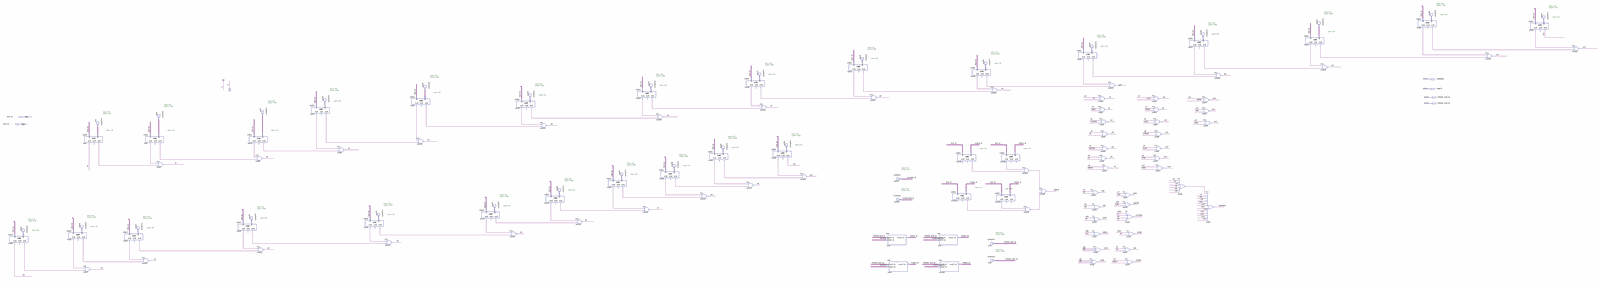
[diagram p0: schematic sheet, whole]
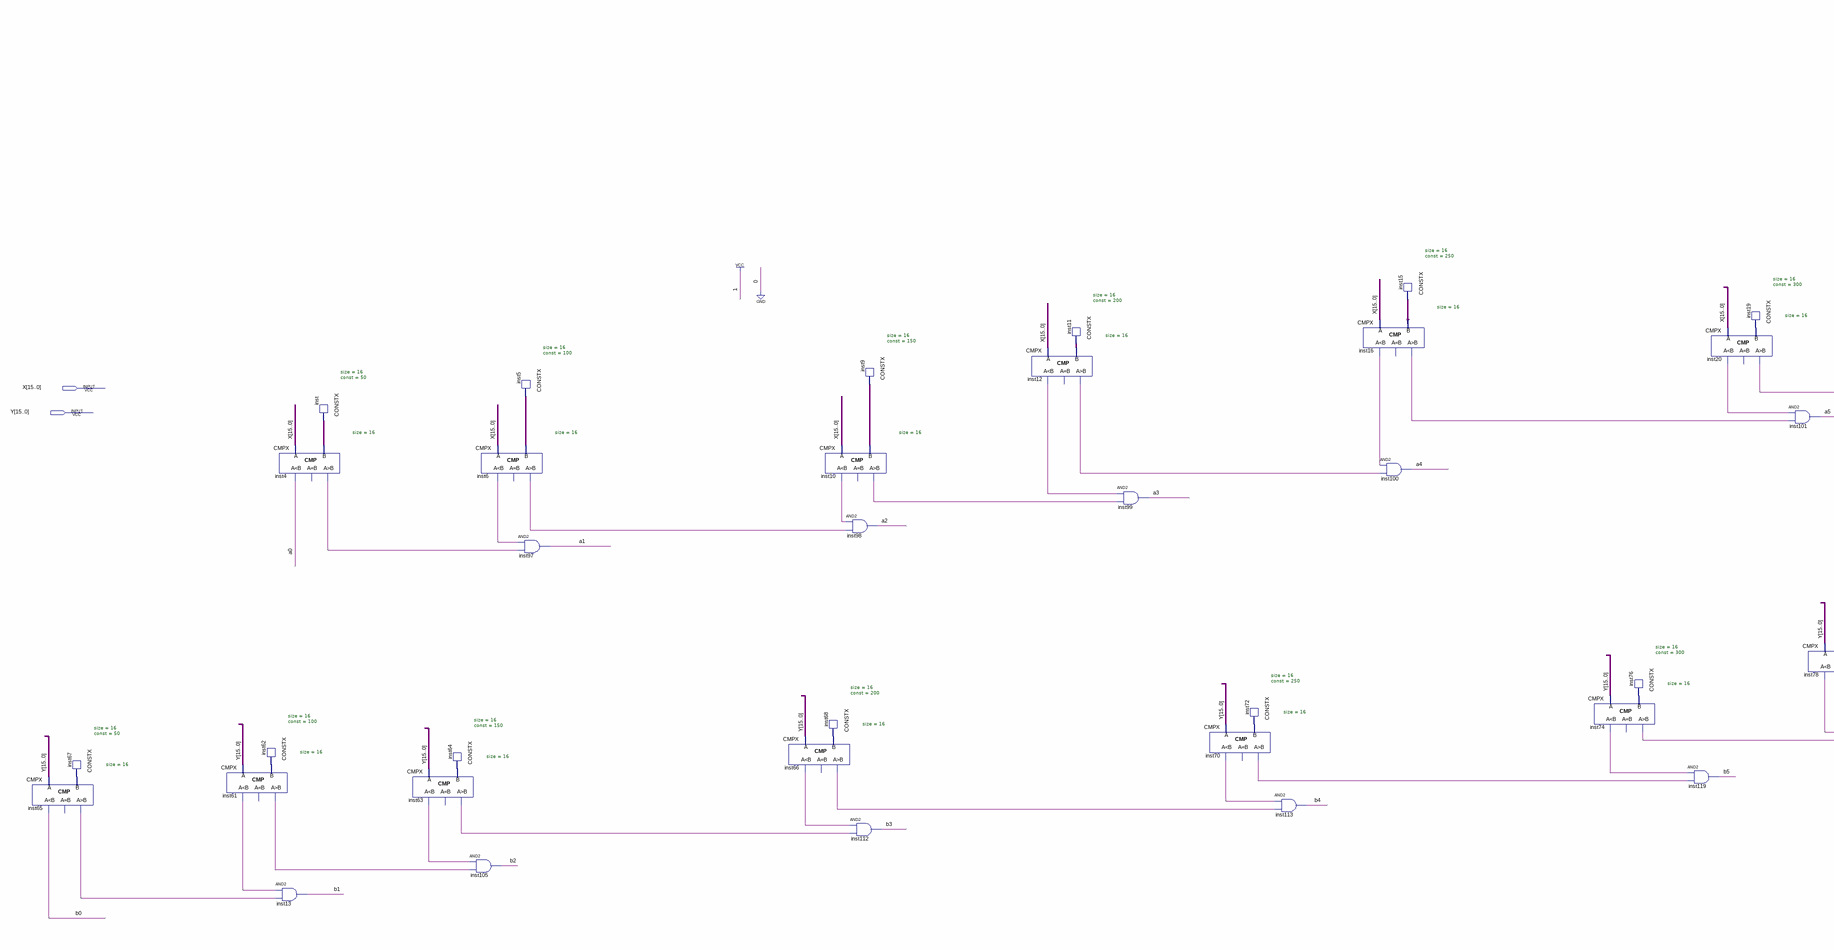
[diagram p1: schematic sheet, left part]
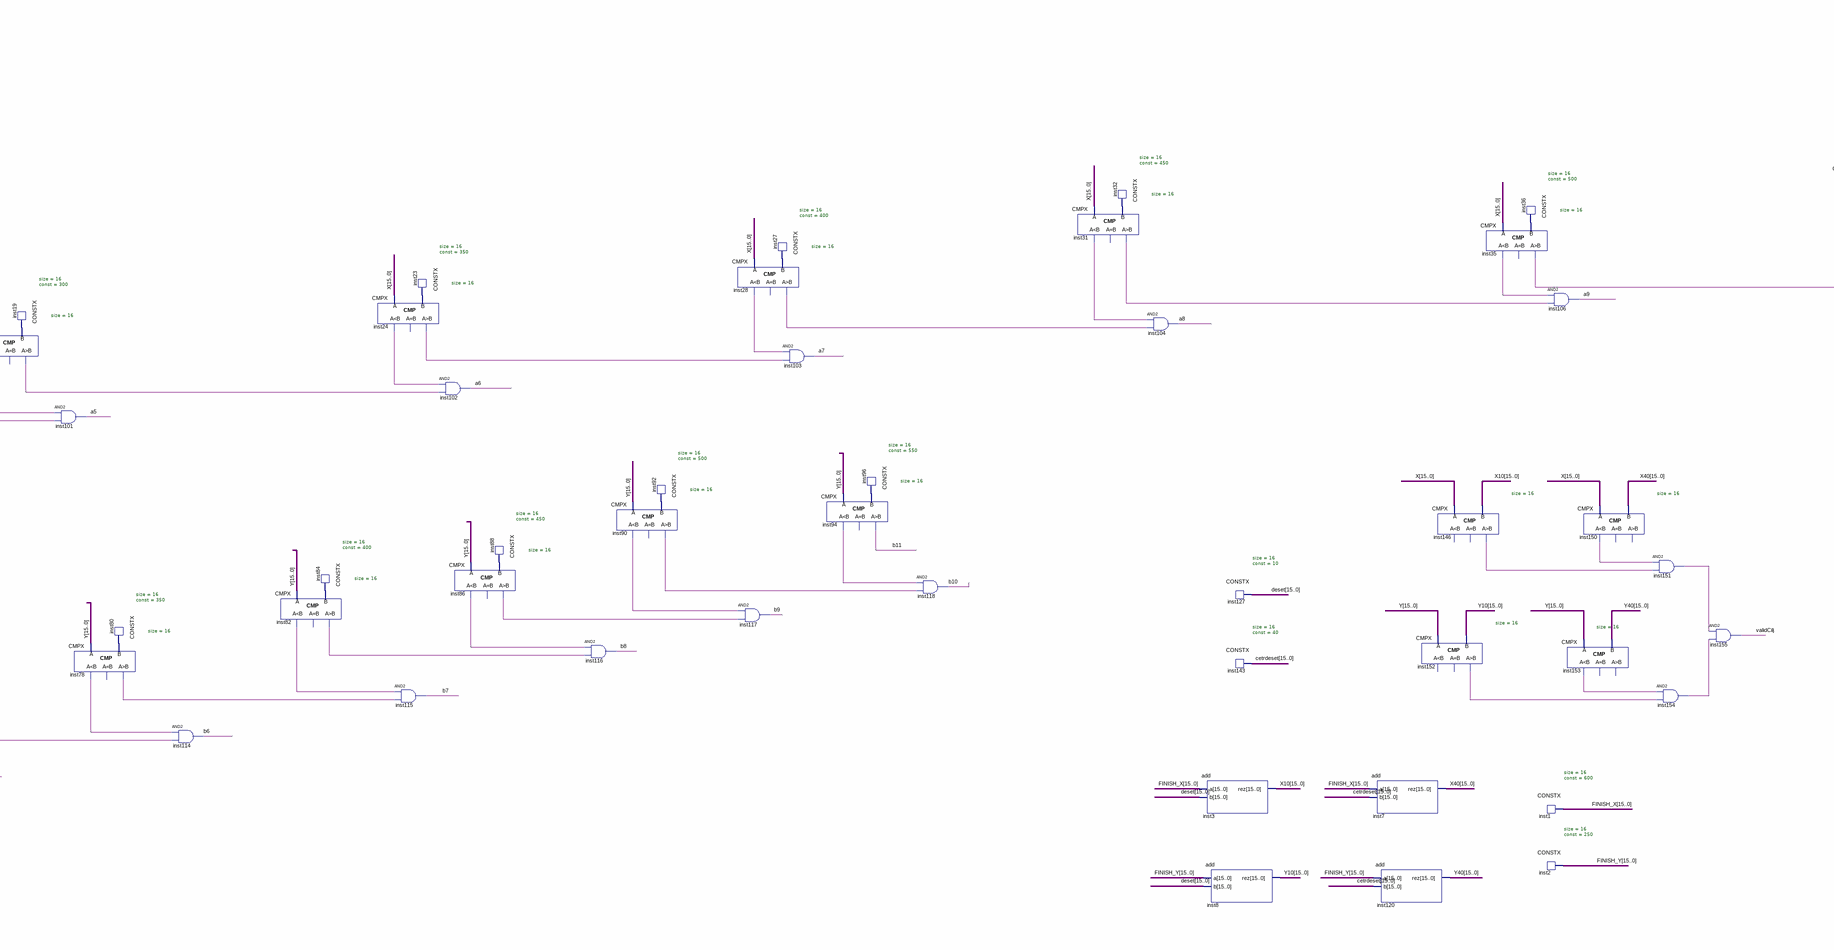
[diagram p2: schematic sheet, centre part]
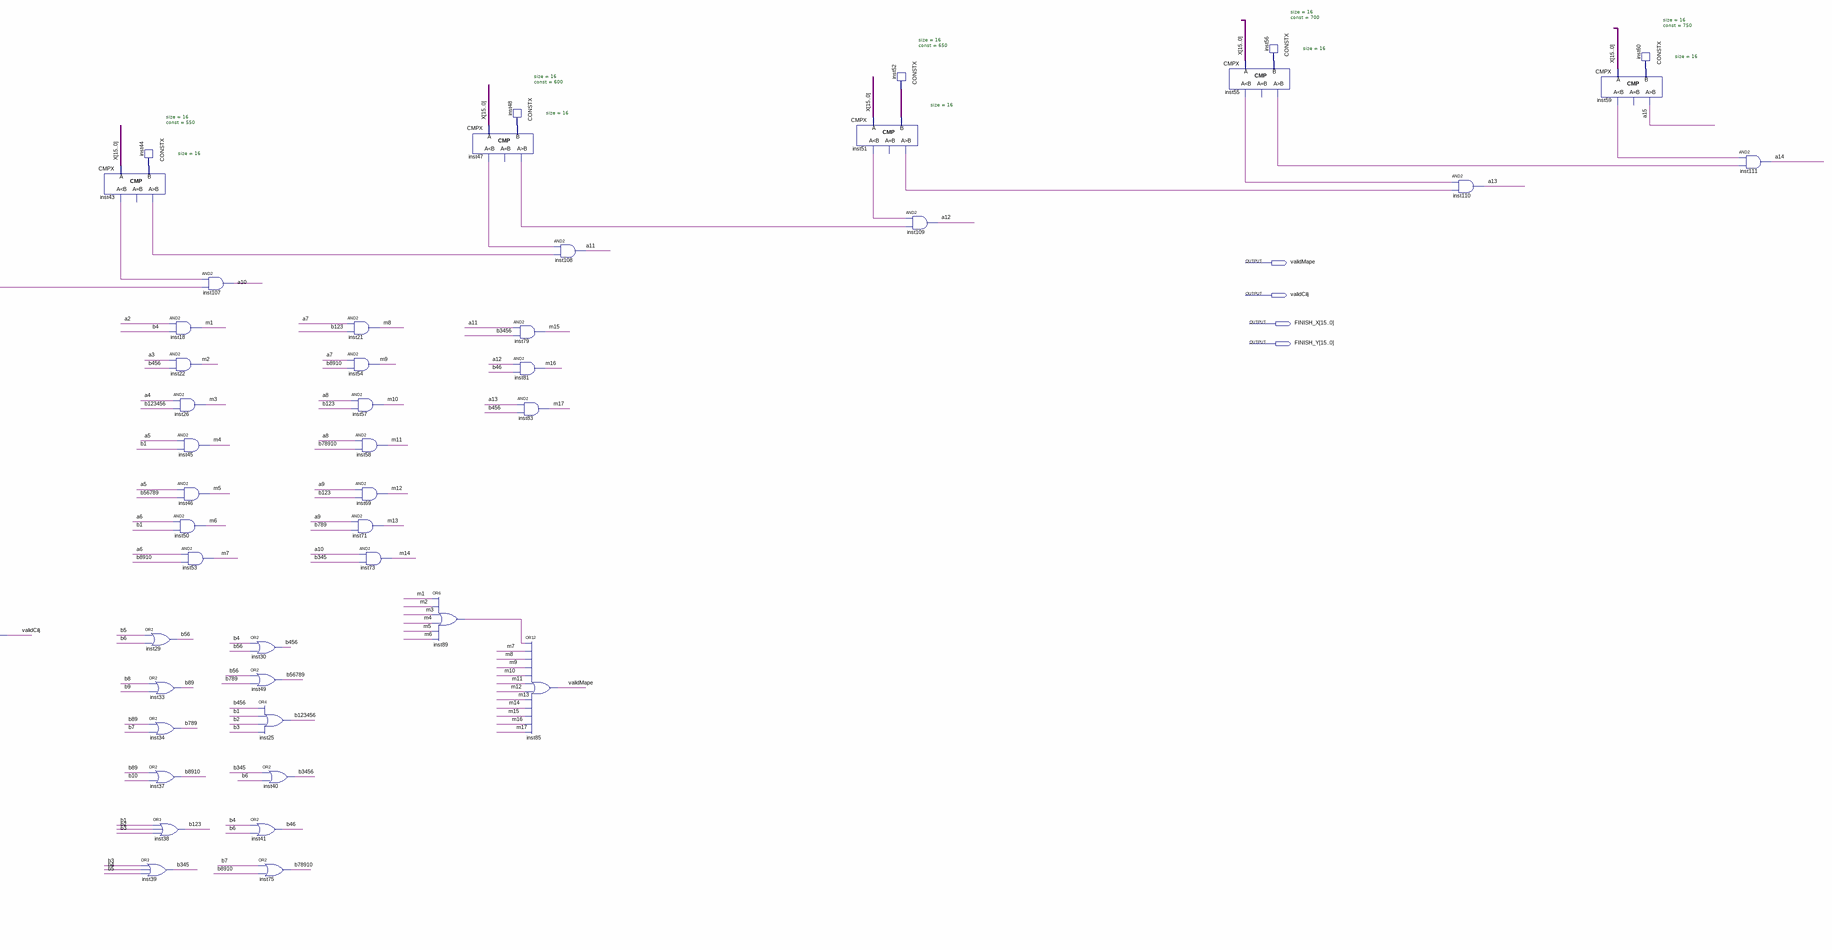
[diagram p3: schematic sheet, right part]
// Quartus schematic mapa2.bdf as structural Verilog: 122 symbols, 6 pins
module mapa2 (
  input  [15:0] X,
  input  [15:0] Y,
  output validMape,
  output validCilj,
  output [15:0] FINISH_X,
  output [15:0] FINISH_Y
);

  wire a0, a1, a2, a3, a4, a5, a6, a7, a8, a9, a10, a11, a12, a13, a14, a15, b0, b1, b2, b3, b4, b5, b6, b7,
       b8, b9, b10, b11, b46, b56, b89, b123, b345, b456, b789, b3456, b8910, b56789, b78910, b123456,
       inst4_gr, inst6_gr, inst6_ls, inst10_gr, inst10_ls, inst12_gr, inst12_ls, inst16_gr, inst16_ls,
       inst20_gr, inst20_ls, inst24_gr, inst24_ls, inst28_gr, inst28_ls, inst31_gr, inst31_ls, inst35_gr,
       inst35_ls, inst43_gr, inst43_ls, inst47_gr, inst47_ls, inst51_gr, inst51_ls, inst55_gr, inst55_ls,
       inst59_ls, inst61_gr, inst61_ls, inst63_gr, inst63_ls, inst65_gr, inst66_gr, inst66_ls, inst70_gr,
       inst70_ls, inst74_gr, inst74_ls, inst78_gr, inst78_ls, inst82_gr, inst82_ls, inst86_gr, inst86_ls,
       inst89_out, inst90_gr, inst90_ls, inst94_ls, inst146_gr, inst150_ls, inst151_out, inst152_gr,
       inst153_ls, inst154_out, m1, m2, m3, m4, m5, m6, m7, m8, m9, m10, m11, m12, m13, m14, m15, m16, m17;
  wire [15:0] cetrdeset, deset, inst5_data, inst9_data, inst11_data, inst15_data, inst19_data, inst23_data,
       inst27_data, inst32_data, inst36_data, inst44_data, inst48_data, inst52_data, inst56_data,
       inst60_data, inst62_data, inst64_data, inst67_data, inst68_data, inst72_data, inst76_data,
       inst80_data, inst84_data, inst88_data, inst92_data, inst96_data, inst_data, X10, X40, Y10, Y40;

  CMPX #(.size(16)) inst65 (.A(Y), .B(inst67_data), .ls(b0), .gr(inst65_gr));  // open: eq
  CONSTX #(.size(16), .\const (50)) inst67 (.data(inst67_data));
  CMPX #(.size(16)) inst61 (.A(Y), .B(inst62_data), .ls(inst61_ls), .gr(inst61_gr));  // open: eq
  CONSTX #(.size(16), .\const (100)) inst62 (.data(inst62_data));
  CMPX #(.size(16)) inst4 (.A(X), .B(inst_data), .ls(a0), .gr(inst4_gr));  // open: eq
  and inst13 (b1, inst61_ls, inst65_gr);
  CONSTX #(.size(16), .\const (50)) inst (.data(inst_data));
  CMPX #(.size(16)) inst63 (.A(Y), .B(inst64_data), .ls(inst63_ls), .gr(inst63_gr));  // open: eq
  CONSTX #(.size(16), .\const (150)) inst64 (.data(inst64_data));
  CMPX #(.size(16)) inst6 (.A(X), .B(inst5_data), .ls(inst6_ls), .gr(inst6_gr));  // open: eq
  and inst105 (b2, inst63_ls, inst61_gr);
  CONSTX #(.size(16), .\const (100)) inst5 (.data(inst5_data));
  and inst97 (a1, inst6_ls, inst4_gr);
  CMPX #(.size(16)) inst66 (.A(Y), .B(inst68_data), .ls(inst66_ls), .gr(inst66_gr));  // open: eq
  CMPX #(.size(16)) inst10 (.A(X), .B(inst9_data), .ls(inst10_ls), .gr(inst10_gr));  // open: eq
  CONSTX #(.size(16), .\const (200)) inst68 (.data(inst68_data));
  CONSTX #(.size(16), .\const (150)) inst9 (.data(inst9_data));
  and inst98 (a2, inst10_ls, inst6_gr);
  and inst112 (b3, inst66_ls, inst63_gr);
  CMPX #(.size(16)) inst12 (.A(X), .B(inst11_data), .ls(inst12_ls), .gr(inst12_gr));  // open: eq
  CONSTX #(.size(16), .\const (200)) inst11 (.data(inst11_data));
  and inst99 (a3, inst12_ls, inst10_gr);
  CMPX #(.size(16)) inst70 (.A(Y), .B(inst72_data), .ls(inst70_ls), .gr(inst70_gr));  // open: eq
  CONSTX #(.size(16), .\const (250)) inst72 (.data(inst72_data));
  and inst113 (b4, inst70_ls, inst66_gr);
  CMPX #(.size(16)) inst16 (.A(X), .B(inst15_data), .ls(inst16_ls), .gr(inst16_gr));  // open: eq
  and inst100 (a4, inst16_ls, inst12_gr);
  CONSTX #(.size(16), .\const (250)) inst15 (.data(inst15_data));
  CMPX #(.size(16)) inst74 (.A(Y), .B(inst76_data), .ls(inst74_ls), .gr(inst74_gr));  // open: eq
  CONSTX #(.size(16), .\const (300)) inst76 (.data(inst76_data));
  CMPX #(.size(16)) inst20 (.A(X), .B(inst19_data), .ls(inst20_ls), .gr(inst20_gr));  // open: eq
  and inst119 (b5, inst74_ls, inst70_gr);
  CONSTX #(.size(16), .\const (300)) inst19 (.data(inst19_data));
  and inst101 (a5, inst20_ls, inst16_gr);
  CMPX #(.size(16)) inst78 (.A(Y), .B(inst80_data), .ls(inst78_ls), .gr(inst78_gr));  // open: eq
  CONSTX #(.size(16), .\const (350)) inst80 (.data(inst80_data));
  and inst114 (b6, inst78_ls, inst74_gr);
  CMPX #(.size(16)) inst82 (.A(Y), .B(inst84_data), .ls(inst82_ls), .gr(inst82_gr));  // open: eq
  CONSTX #(.size(16), .\const (400)) inst84 (.data(inst84_data));
  CMPX #(.size(16)) inst24 (.A(X), .B(inst23_data), .ls(inst24_ls), .gr(inst24_gr));  // open: eq
  and inst115 (b7, inst82_ls, inst78_gr);
  CONSTX #(.size(16), .\const (350)) inst23 (.data(inst23_data));
  and inst102 (a6, inst24_ls, inst20_gr);
  CMPX #(.size(16)) inst86 (.A(Y), .B(inst88_data), .ls(inst86_ls), .gr(inst86_gr));  // open: eq
  CONSTX #(.size(16), .\const (450)) inst88 (.data(inst88_data));
  and inst116 (b8, inst86_ls, inst82_gr);
  CMPX #(.size(16)) inst90 (.A(Y), .B(inst92_data), .ls(inst90_ls), .gr(inst90_gr));  // open: eq
  CONSTX #(.size(16), .\const (500)) inst92 (.data(inst92_data));
  CMPX #(.size(16)) inst28 (.A(X), .B(inst27_data), .ls(inst28_ls), .gr(inst28_gr));  // open: eq
  and inst117 (b9, inst90_ls, inst86_gr);
  CONSTX #(.size(16), .\const (400)) inst27 (.data(inst27_data));
  and inst103 (a7, inst28_ls, inst24_gr);
  CMPX #(.size(16)) inst94 (.A(Y), .B(inst96_data), .ls(inst94_ls), .gr(b11));  // open: eq
  CONSTX #(.size(16), .\const (550)) inst96 (.data(inst96_data));
  and inst118 (b10, inst94_ls, inst90_gr);
  CMPX #(.size(16)) inst31 (.A(X), .B(inst32_data), .ls(inst31_ls), .gr(inst31_gr));  // open: eq
  CONSTX #(.size(16), .\const (450)) inst32 (.data(inst32_data));
  and inst104 (a8, inst31_ls, inst28_gr);
  add inst3 (.a(FINISH_X), .b(deset), .rez(X10));
  add inst8 (.a(FINISH_Y), .b(deset), .rez(Y10));
  CONSTX #(.size(16), .\const (10)) inst127 (.data(deset));
  CONSTX #(.size(16), .\const (40)) inst143 (.data(cetrdeset));
  add inst7 (.a(FINISH_X), .b(cetrdeset), .rez(X40));
  add inst120 (.a(FINISH_Y), .b(cetrdeset), .rez(Y40));
  CMPX #(.size(16)) inst146 (.A(X), .B(X10), .gr(inst146_gr));  // open: ls, eq
  CMPX #(.size(16)) inst152 (.A(Y), .B(Y10), .gr(inst152_gr));  // open: ls, eq
  CMPX #(.size(16)) inst35 (.A(X), .B(inst36_data), .ls(inst35_ls), .gr(inst35_gr));  // open: eq
  CONSTX #(.size(16), .\const (500)) inst36 (.data(inst36_data));
  CONSTX #(.size(16), .\const (600)) inst1 (.data(FINISH_X));
  CONSTX #(.size(16), .\const (250)) inst2 (.data(FINISH_Y));
  and inst106 (a9, inst35_ls, inst31_gr);
  CMPX #(.size(16)) inst153 (.A(Y), .B(Y40), .ls(inst153_ls));  // open: eq, gr
  CMPX #(.size(16)) inst150 (.A(X), .B(X40), .ls(inst150_ls));  // open: eq, gr
  and inst151 (inst151_out, inst150_ls, inst146_gr);
  and inst154 (inst154_out, inst153_ls, inst152_gr);
  and inst155 (validCilj, inst151_out, inst154_out);
  CMPX #(.size(16)) inst43 (.A(X), .B(inst44_data), .ls(inst43_ls), .gr(inst43_gr));  // open: eq
  CONSTX #(.size(16), .\const (550)) inst44 (.data(inst44_data));
  or inst29 (b56, b5, b6);
  or inst33 (b89, b8, b9);
  or inst34 (b789, b89, b7);
  or inst37 (b8910, b89, b10);
  or inst38 (b123, b1, b2, b3);
  or inst39 (b345, b3, b4, b5);
  and inst18 (m1, a2, b4);
  and inst22 (m2, a3, b456);
  and inst26 (m3, a4, b123456);
  and inst45 (m4, a5, b1);
  and inst46 (m5, a5, b56789);
  and inst50 (m6, a6, b1);
  and inst53 (m7, a6, b8910);
  and inst107 (a10, inst43_ls, inst35_gr);
  or inst30 (b456, b4, b56);
  or inst49 (b56789, b56, b789);
  or inst41 (b46, b4, b6);
  or inst25 (b123456, b456, b1, b2, b3);
  or inst40 (b3456, b345, b6);
  or inst75 (b78910, b7, b8910);
  and inst21 (m8, a7, b123);
  and inst54 (m9, a7, b8910);
  and inst57 (m10, a8, b123);
  and inst71 (m13, a9, b789);
  and inst58 (m11, a8, b78910);
  and inst69 (m12, a9, b123);
  and inst73 (m14, a10, b345);
  or inst89 (inst89_out, m1, m2, m3, m4, m5, m6);
  CMPX #(.size(16)) inst47 (.A(X), .B(inst48_data), .ls(inst47_ls), .gr(inst47_gr));  // open: eq
  CONSTX #(.size(16), .\const (600)) inst48 (.data(inst48_data));
  and inst79 (m15, a11, b3456);
  and inst81 (m16, a12, b46);
  and inst83 (m17, a13, b456);
  or inst85 (validMape, inst89_out, m7, m8, m9, m10, m11, m12, m13, m14, m15, m16, m17);
  and inst108 (a11, inst47_ls, inst43_gr);
  CMPX #(.size(16)) inst51 (.A(X), .B(inst52_data), .ls(inst51_ls), .gr(inst51_gr));  // open: eq
  CONSTX #(.size(16), .\const (650)) inst52 (.data(inst52_data));
  and inst109 (a12, inst51_ls, inst47_gr);
  CMPX #(.size(16)) inst55 (.A(X), .B(inst56_data), .ls(inst55_ls), .gr(inst55_gr));  // open: eq
  CONSTX #(.size(16), .\const (700)) inst56 (.data(inst56_data));
  and inst110 (a13, inst55_ls, inst51_gr);
  CMPX #(.size(16)) inst59 (.A(X), .B(inst60_data), .ls(inst59_ls), .gr(a15));  // open: eq
  CONSTX #(.size(16), .\const (750)) inst60 (.data(inst60_data));
  and inst111 (a14, inst59_ls, inst55_gr);
endmodule
